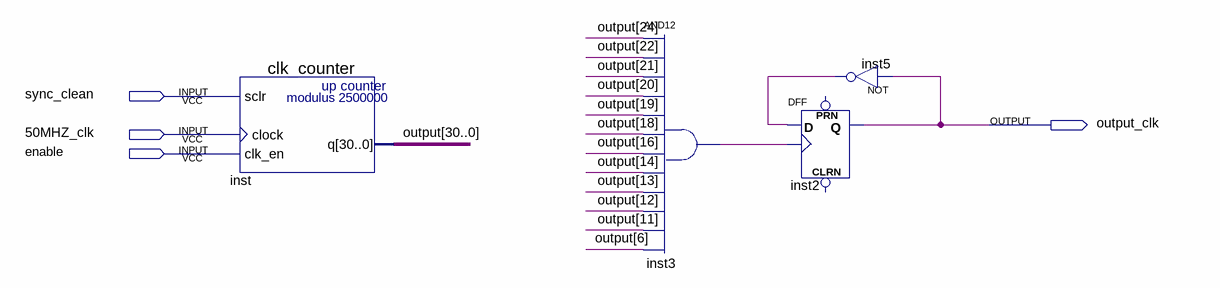
[diagram p0: schematic sheet]
// Quartus schematic main_clk.bdf as structural Verilog: 4 symbols, 4 pins
module main_clk (
  input  sync_clean,
  input  \50MHZ_clk ,
  input  enable,
  output output_clk
);

  wire inst3_out, inst5_out;
  wire [30:0] \output ;

  clk_counter inst (.sclr(sync_clean), .clock(\50MHZ_clk ), .clk_en(enable), .q(\output ));
  and inst3 (inst3_out, \output [24], \output [22], \output [21], \output [20], \output [19], \output [18], \output [16], \output [14], \output [13], \output [12], \output [11], \output [6]);
  DFF inst2 (.CLK(inst3_out), .D(inst5_out), .Q(output_clk));  // open: CLRN, PRN
  not inst5 (inst5_out, output_clk);
endmodule
